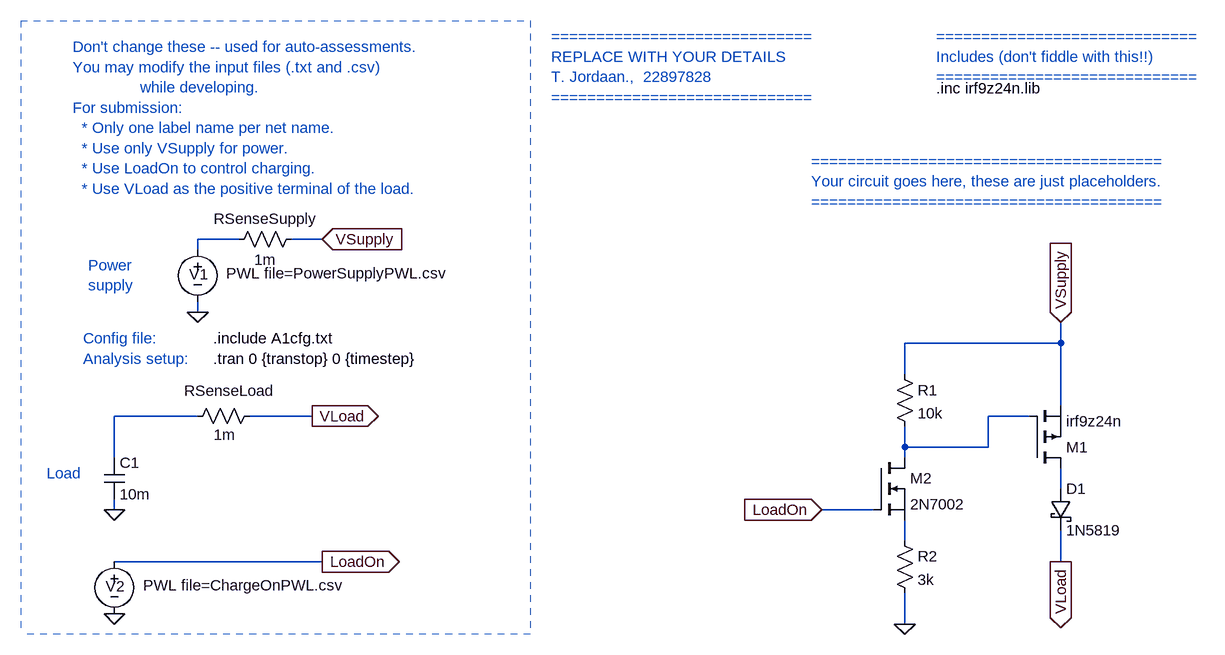
[diagram p0: schematic E344_22897828_A1.asc]
E344_22897828_A1.asc, the LTspice schematic file:
Version 4
SHEET 1 1824 680
WIRE -2032 -1088 -2096 -1088
WIRE -1904 -1088 -1952 -1088
WIRE -2096 -1072 -2096 -1088
WIRE -2096 -976 -2096 -992
WIRE -768 -928 -768 -960
WIRE -768 -928 -1008 -928
WIRE -1008 -880 -1008 -928
WIRE -768 -832 -768 -928
WIRE -2096 -816 -2224 -816
WIRE -1920 -816 -2016 -816
WIRE -816 -816 -880 -816
WIRE -1008 -768 -1008 -800
WIRE -880 -768 -880 -816
WIRE -880 -768 -1008 -768
WIRE -2224 -752 -2224 -816
WIRE -1008 -752 -1008 -768
WIRE -768 -704 -768 -736
WIRE -2224 -672 -2224 -688
WIRE -1056 -672 -1136 -672
WIRE -1008 -624 -1008 -656
WIRE -1904 -592 -2224 -592
WIRE -768 -592 -768 -640
WIRE -1008 -496 -1008 -544
FLAG -2096 -976 0
FLAG -1904 -1088 VSupply
IOPIN -1904 -1088 In
FLAG -1920 -816 VLoad
IOPIN -1920 -816 Out
FLAG -1904 -592 LoadOn
IOPIN -1904 -592 Out
FLAG -2224 -512 0
FLAG -768 -960 VSupply
IOPIN -768 -960 In
FLAG -768 -592 VLoad
IOPIN -768 -592 Out
FLAG -1136 -672 LoadOn
IOPIN -1136 -672 In
FLAG -2224 -672 0
FLAG -1008 -496 0
SYMBOL voltage -2096 -1088 R0
WINDOW 123 0 0 Left 0
WINDOW 39 0 0 Left 0
WINDOW 3 44 52 Left 2
WINDOW 0 -13 54 Left 2
SYMATTR Value PWL file=PowerSupplyPWL.csv
SYMATTR InstName V1
SYMBOL res -2000 -832 R90
WINDOW 0 -7 47 VBottom 2
WINDOW 3 29 54 VTop 2
SYMATTR InstName RSenseLoad
SYMATTR Value 1m
SYMBOL res -2048 -1072 R270
WINDOW 0 32 56 VTop 2
WINDOW 3 0 56 VBottom 2
SYMATTR InstName RSenseSupply
SYMATTR Value 1m
SYMBOL cap -2240 -752 R0
SYMATTR InstName C1
SYMATTR Value 10m
SYMATTR SpiceLine2 IC=0
SYMBOL voltage -2224 -608 R0
WINDOW 123 0 0 Left 0
WINDOW 39 0 0 Left 0
WINDOW 3 44 52 Left 2
WINDOW 0 -13 54 Left 2
SYMATTR Value PWL file=ChargeOnPWL.csv
SYMATTR InstName V2
SYMBOL pmos -816 -736 M180
SYMATTR InstName M1
SYMATTR Value irf9z24n
SYMATTR Prefix X
SYMATTR SpiceModel irf9z24n
SYMBOL nmos -1056 -752 R0
SYMATTR InstName M2
SYMATTR Value 2N7002
SYMBOL schottky -784 -704 R0
SYMATTR InstName D1
SYMATTR Value 1N5819
SYMATTR Description Diode
SYMATTR Type diode
SYMBOL res -1024 -896 R0
SYMATTR InstName R1
SYMATTR Value 10k
SYMBOL res -1024 -640 R0
SYMATTR InstName R2
SYMATTR Value 3k
TEXT -2072 -904 Left 2 !.tran 0 {transtop} 0 {timestep}
TEXT -2072 -936 Left 2 !.include A1cfg.txt
TEXT -2288 -1384 Left 2 ;Don't change these -- used for auto-assessments.\nYou may modify the input files (.txt and .csv) \n               while developing.\nFor submission: \n  * Only one label name per net name.\n  * Use only VSupply for power.\n  * Use LoadOn to control charging.\n  * Use VLoad as the positive terminal of the load.
TEXT -2272 -936 Left 2 ;Config file:
TEXT -2272 -904 Left 2 ;Analysis setup:
TEXT -2328 -728 Left 2 ;Load
TEXT -2264 -1048 Left 2 ;Power\nsupply
TEXT -1552 -1400 Left 2 ;=============================\nREPLACE WITH YOUR DETAILS\nT. Jordaan.,  22897828\n=============================
TEXT -960 -1320 Left 2 !.inc irf9z24n.lib
TEXT -960 -1400 Left 2 ;=============================\nIncludes (don't fiddle with this!!)\n=============================
TEXT -1152 -1208 Left 2 ;=======================================\nYour circuit goes here, these are just placeholders.\n=======================================
LINE Normal -1584 -1424 -1584 -480 2
LINE Normal -2368 -1424 -1584 -1424 2
LINE Normal -1584 -480 -2368 -480 2
LINE Normal -1584 -496 -1584 -496 2
LINE Normal -2368 -1424 -2368 -480 2

The netlist it stands for:
* E344_22897828_A1.asc
V1 N001 0 PWL file=PowerSupplyPWL.csv
RSenseLoad VLoad N002 1m
RSenseSupply N001 VSupply 1m
C1 N002 0 10m IC=0
V2 LoadOn 0 PWL file=ChargeOnPWL.csv
XM1 N004 N003 VSupply irf9z24n irf9z24n  ; pins D G S
M2 N003 LoadOn N005 N005 2N7002
D1 N004 VLoad 1N5819
R1 VSupply N003 10k
R2 N005 0 3k
.model D D
.lib standard.dio
.model NMOS NMOS
.model PMOS PMOS
.lib standard.mos
.tran 0 {transtop} 0 {timestep}
.include A1cfg.txt
* Don't change these -- used for auto-assessments.
* You may modify the input files (.txt and .csv)
*                while developing.
* For submission:
*   * Only one label name per net name.
*   * Use only VSupply for power.
*   * Use LoadOn to control charging.
*   * Use VLoad as the positive terminal of the load.
* Config file:
* Analysis setup:
* Load
* Power
* supply
* =============================
* REPLACE WITH YOUR DETAILS
* T. Jordaan.,  22897828
* =============================
.inc irf9z24n.lib
* =============================
* Includes (don't fiddle with this!!)
* =============================
* =======================================
* Your circuit goes here, these are just placeholders.
* =======================================
.backanno
.end